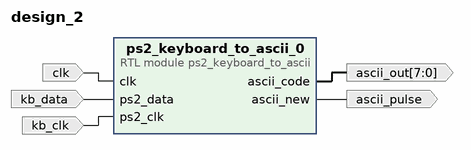
[diagram p0: block diagram of the top level]
# Vivado block design design_2, xc7z007sclg400-1, Vivado 2019.1
create_bd_design design_2

create_bd_port -dir I clk
create_bd_port -dir O -from 7 -to 0 ascii_out
create_bd_port -dir O ascii_pulse
create_bd_port -dir I kb_data
create_bd_port -dir I kb_clk

create_bd_cell -type module -reference ps2_keyboard_to_ascii ps2_keyboard_to_ascii_0

# ---- connections ----

connect_bd_net [get_bd_ports clk] [get_bd_pins ps2_keyboard_to_ascii_0/clk]
connect_bd_net [get_bd_pins ps2_keyboard_to_ascii_0/ascii_code] [get_bd_ports ascii_out]
connect_bd_net [get_bd_pins ps2_keyboard_to_ascii_0/ascii_new] [get_bd_ports ascii_pulse]
connect_bd_net [get_bd_ports kb_data] [get_bd_pins ps2_keyboard_to_ascii_0/ps2_data]
connect_bd_net [get_bd_ports kb_clk] [get_bd_pins ps2_keyboard_to_ascii_0/ps2_clk]

validate_bd_design
save_bd_design
